# EasyEDA Pro project ProProject_Yuzuki Chameleon_2023-09-02.epro, schematic 100ASK

## Sheets
1 POWER
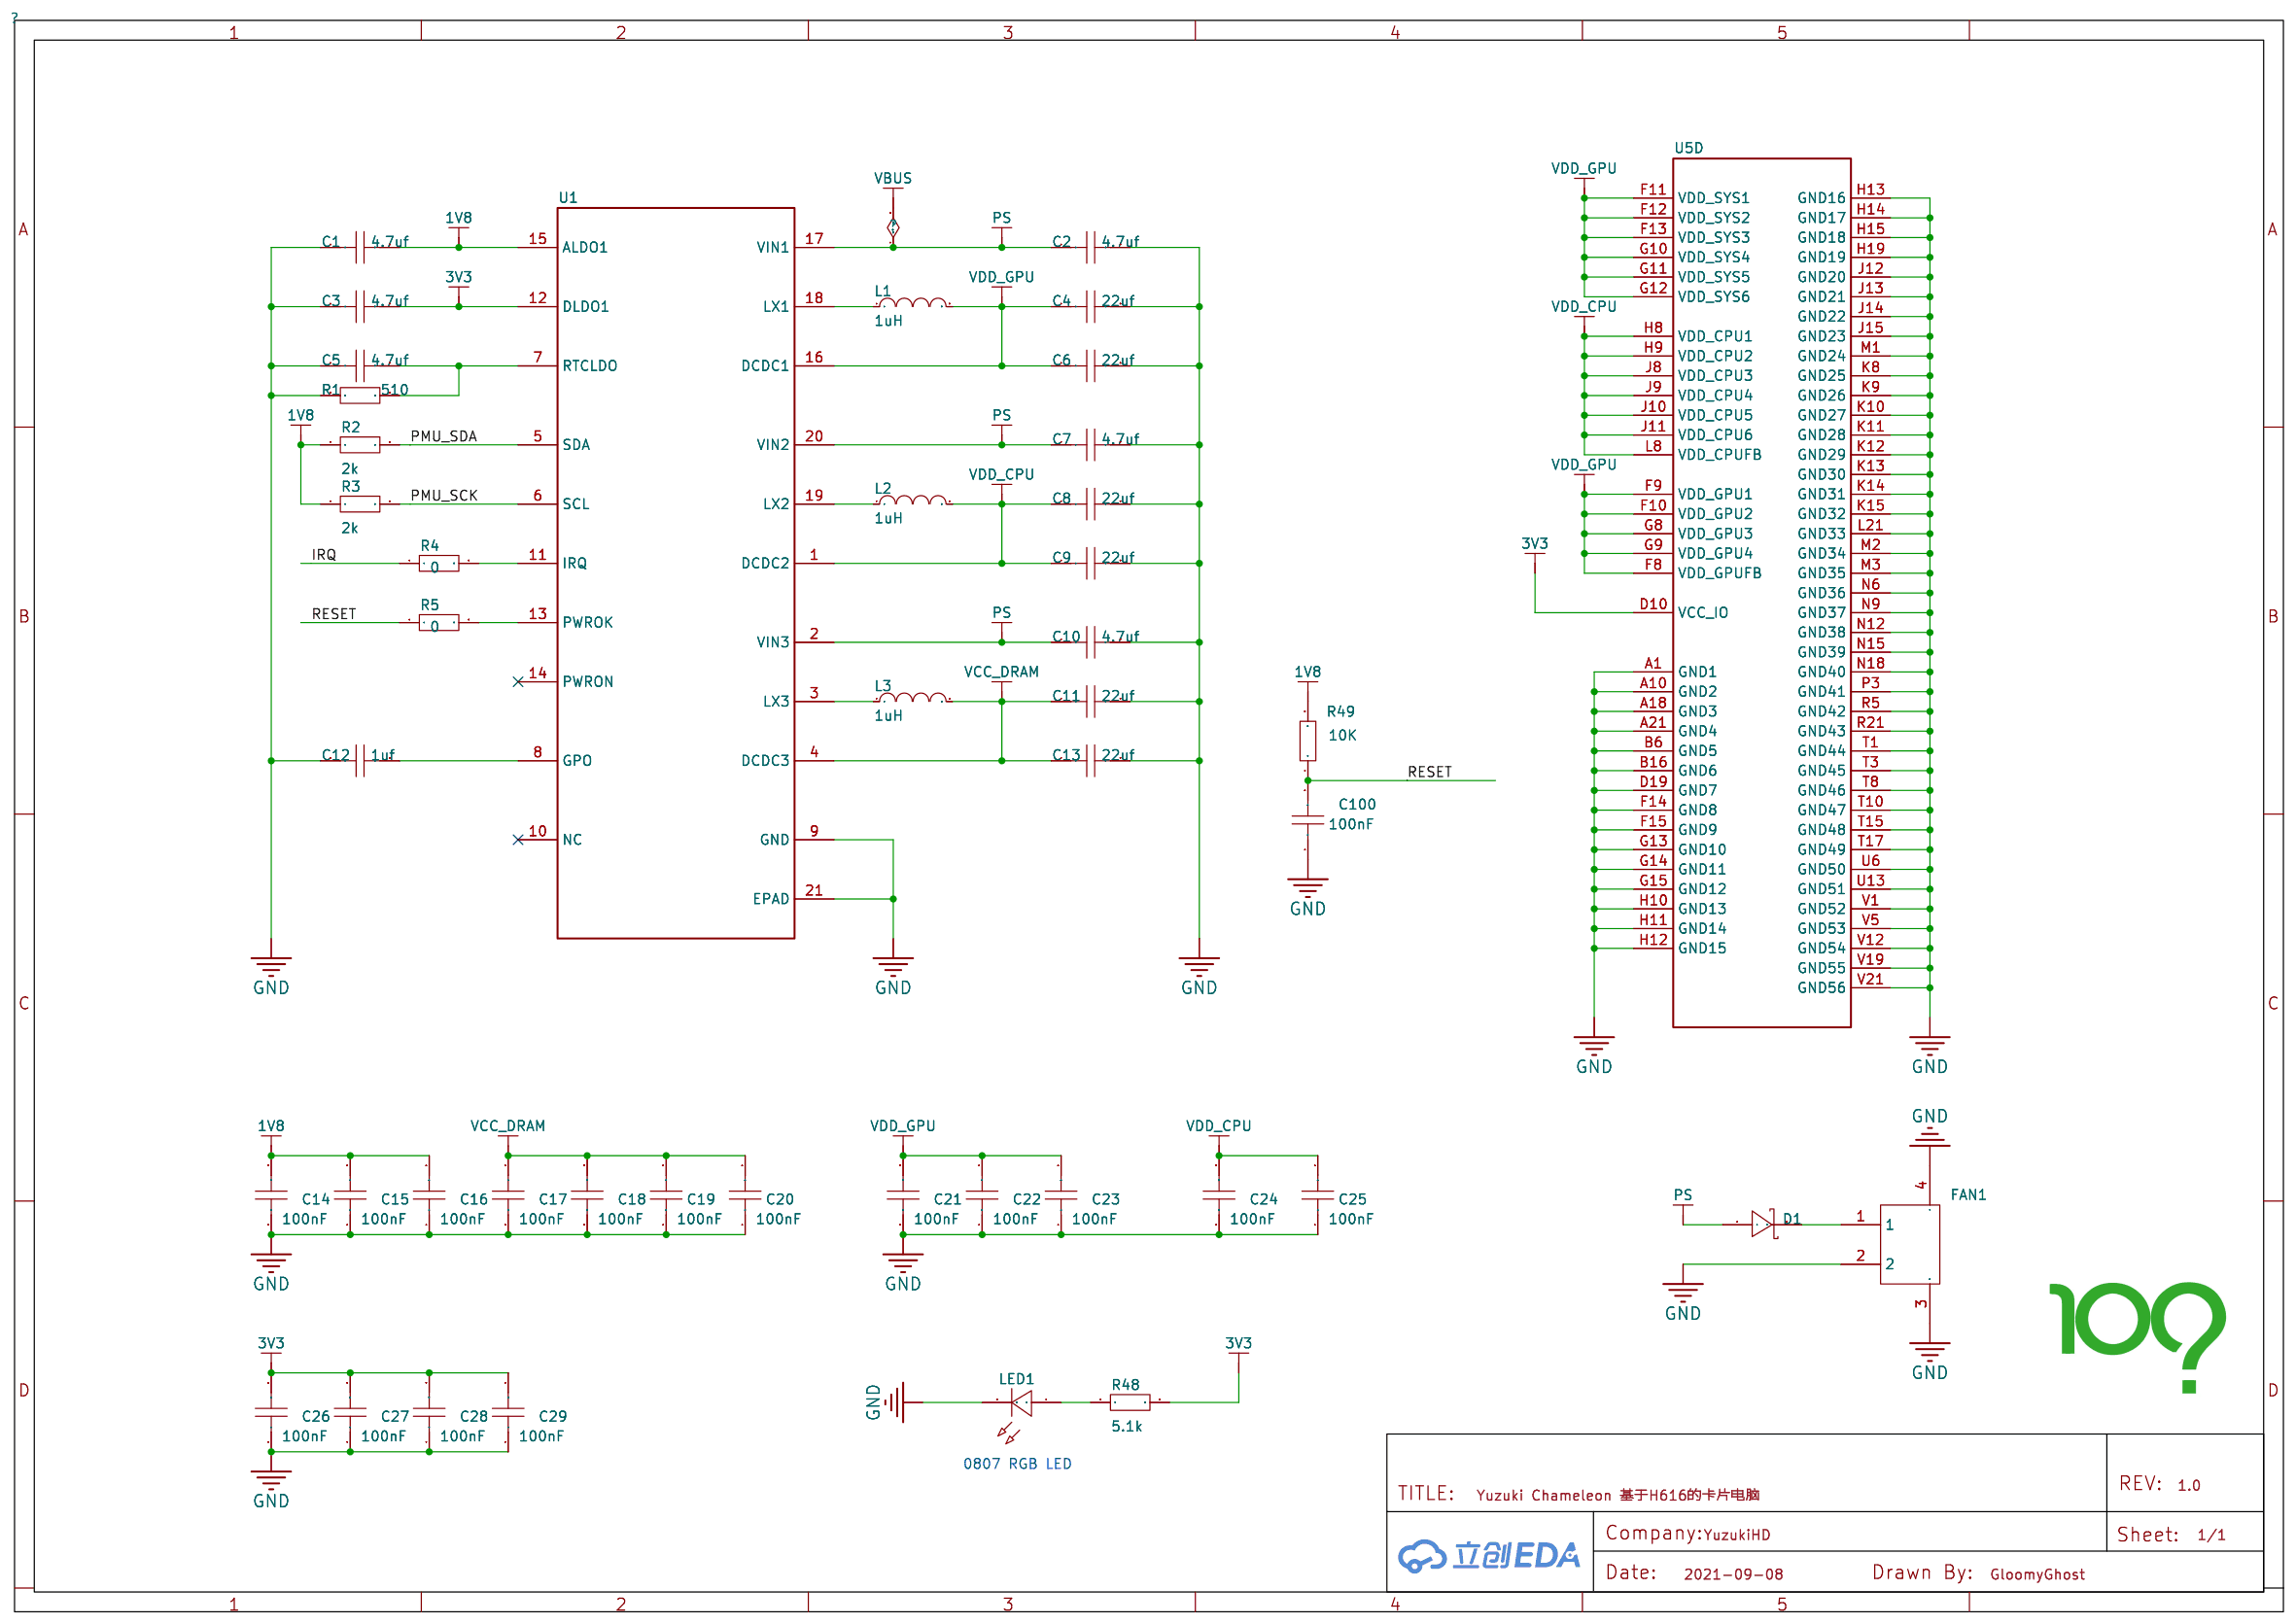
[diagram p0: POWER]
2 DRAM
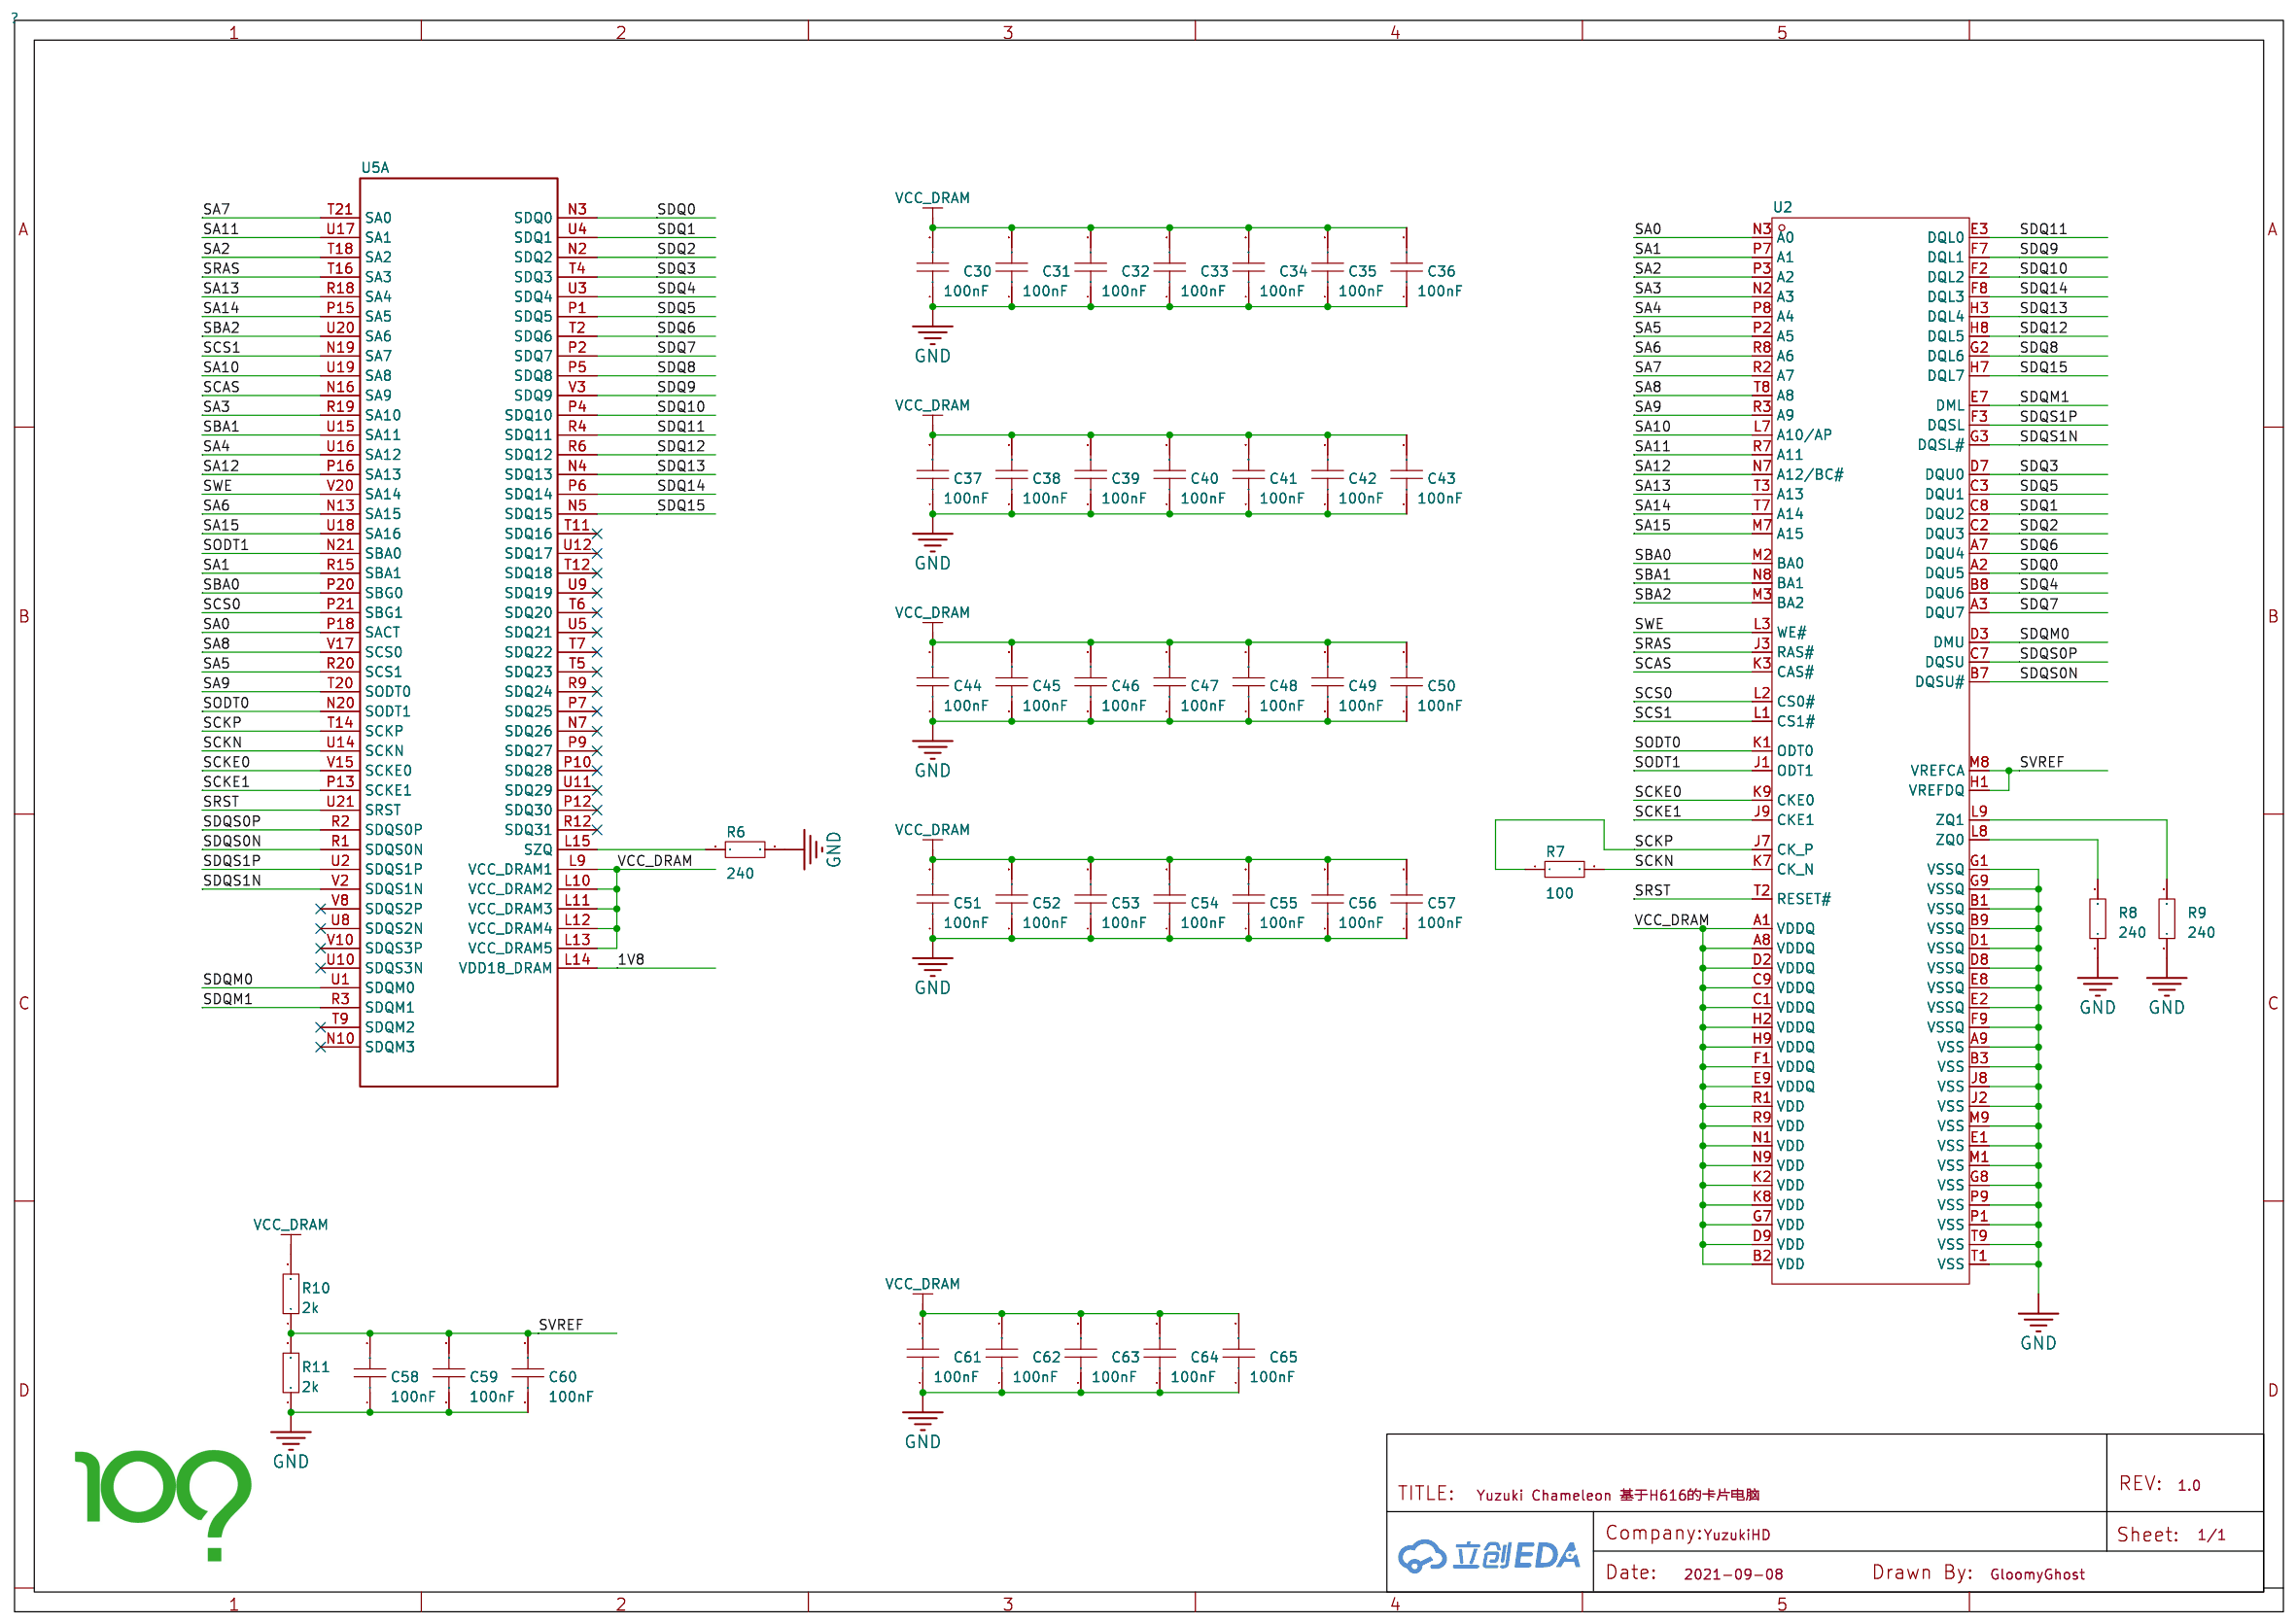
[diagram p1: DRAM]
3 IO
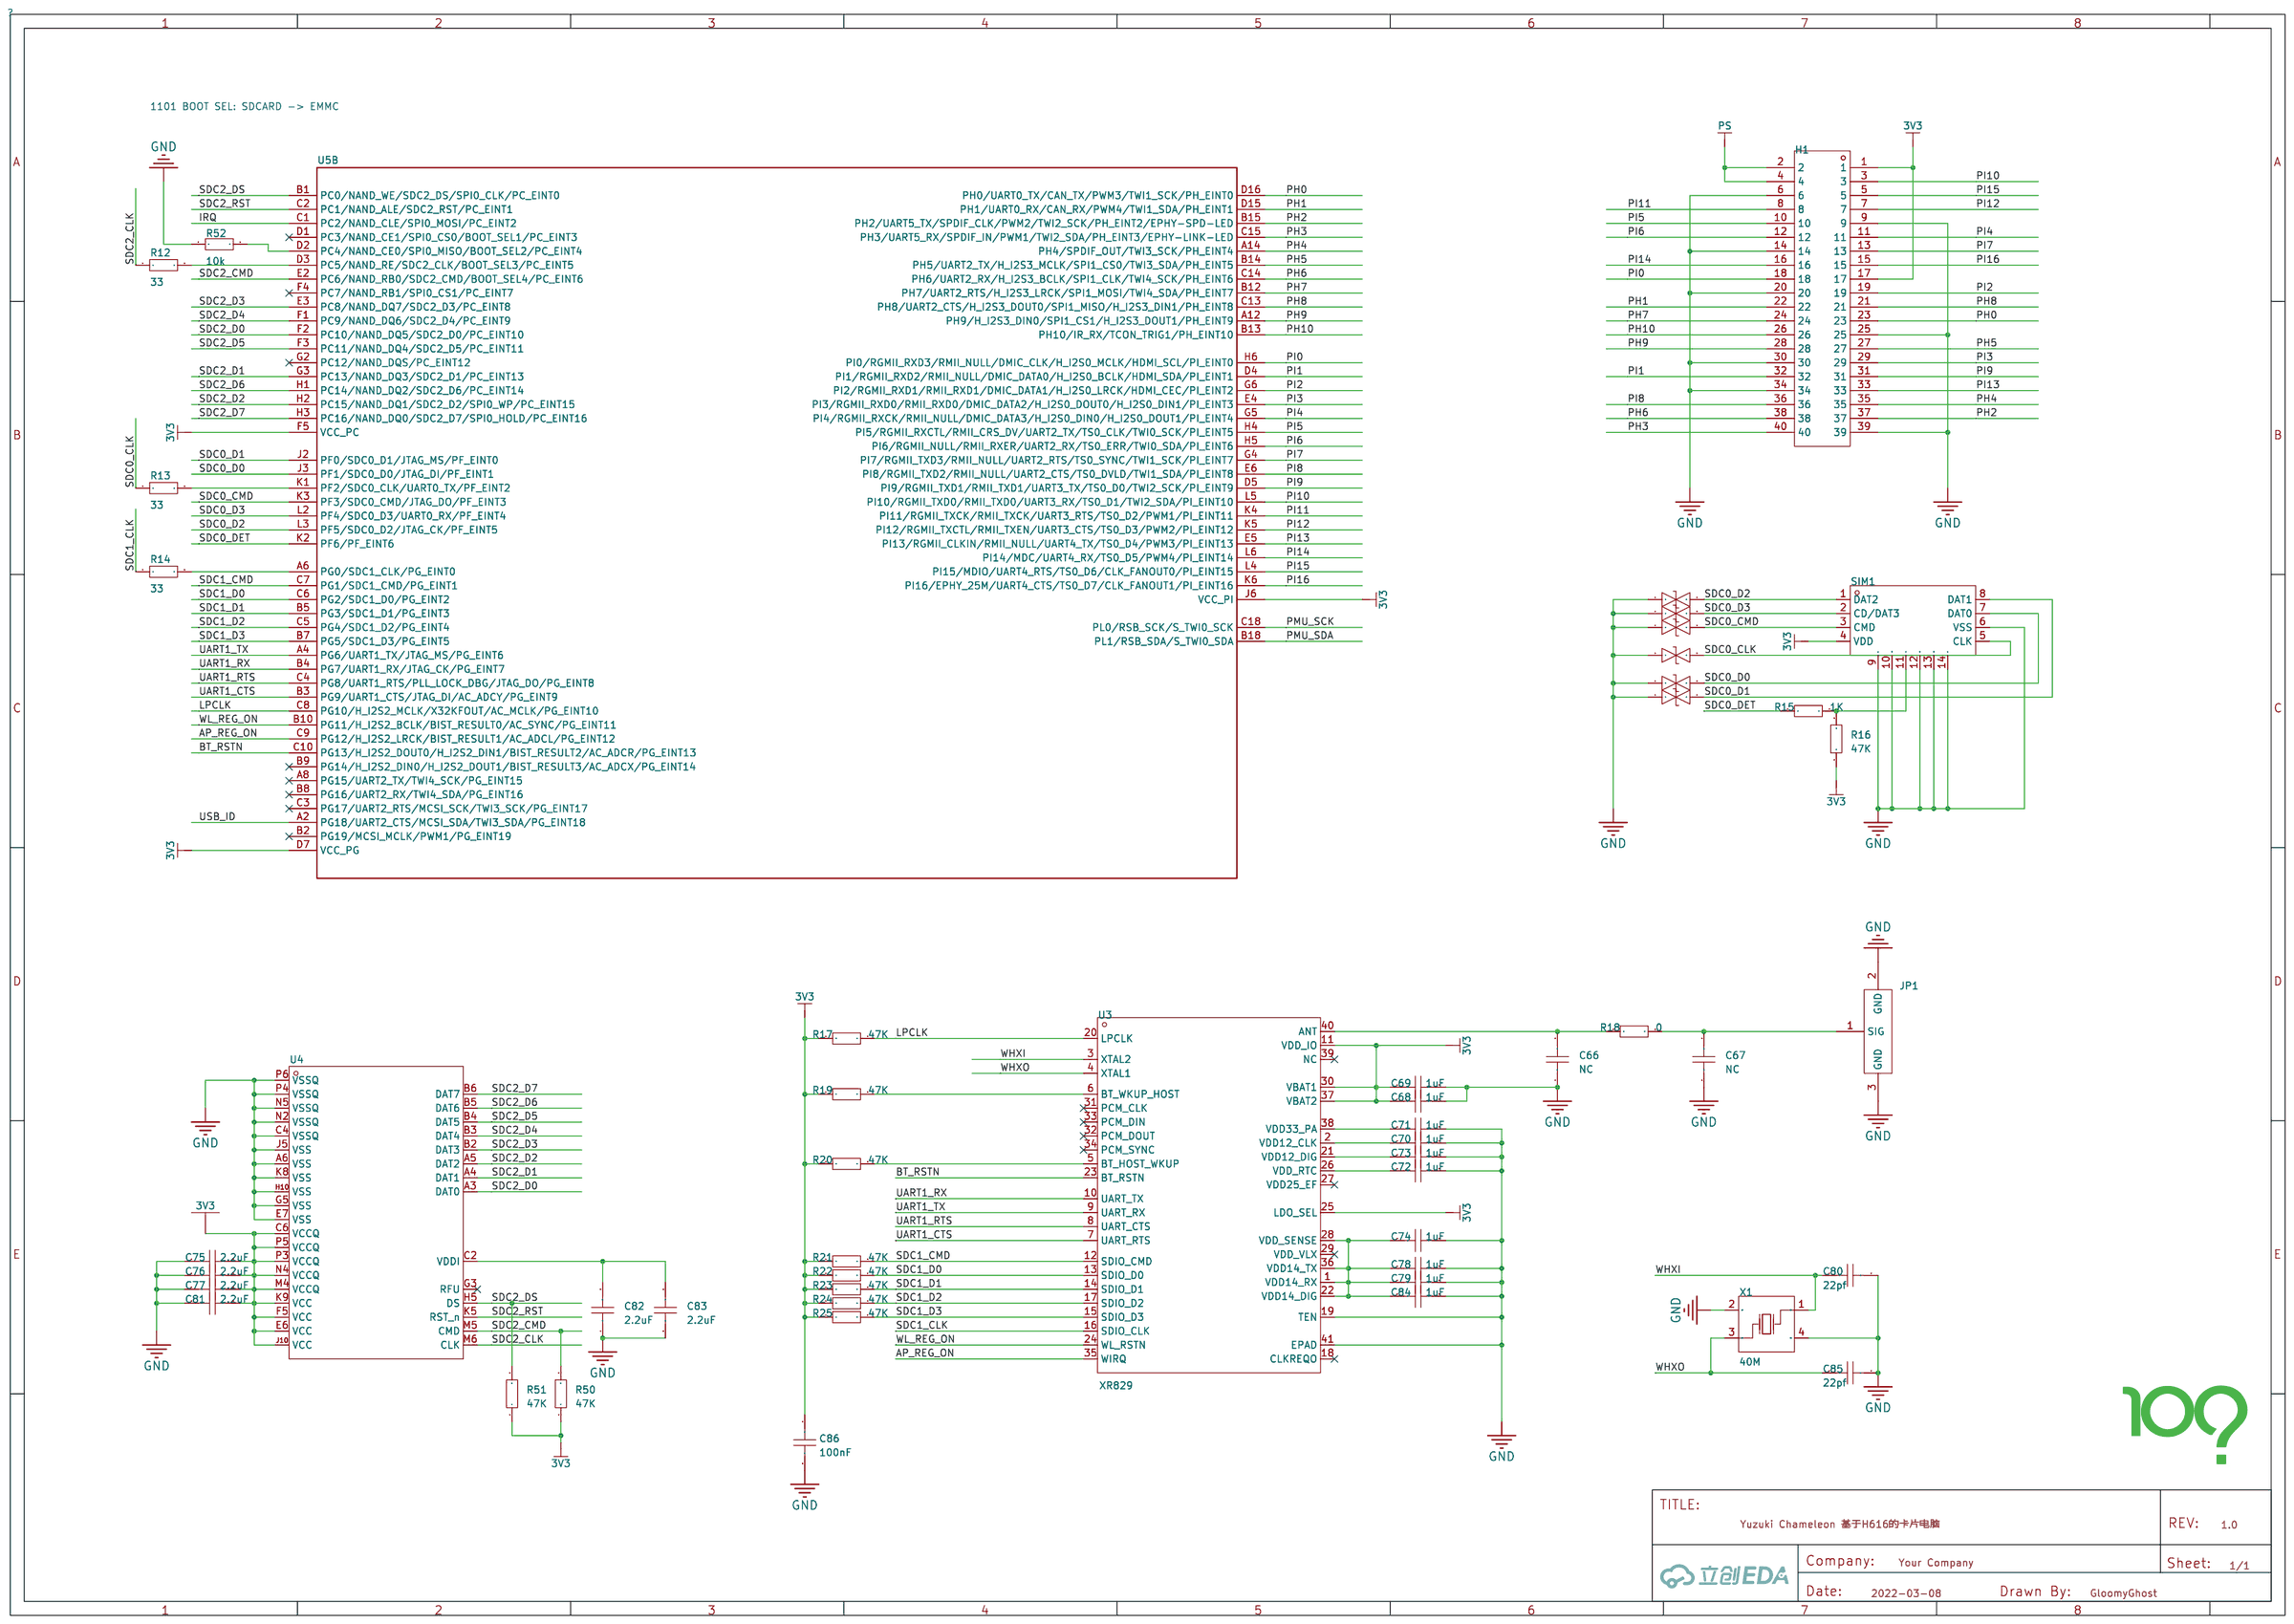
[diagram p2: IO]
4 PREP
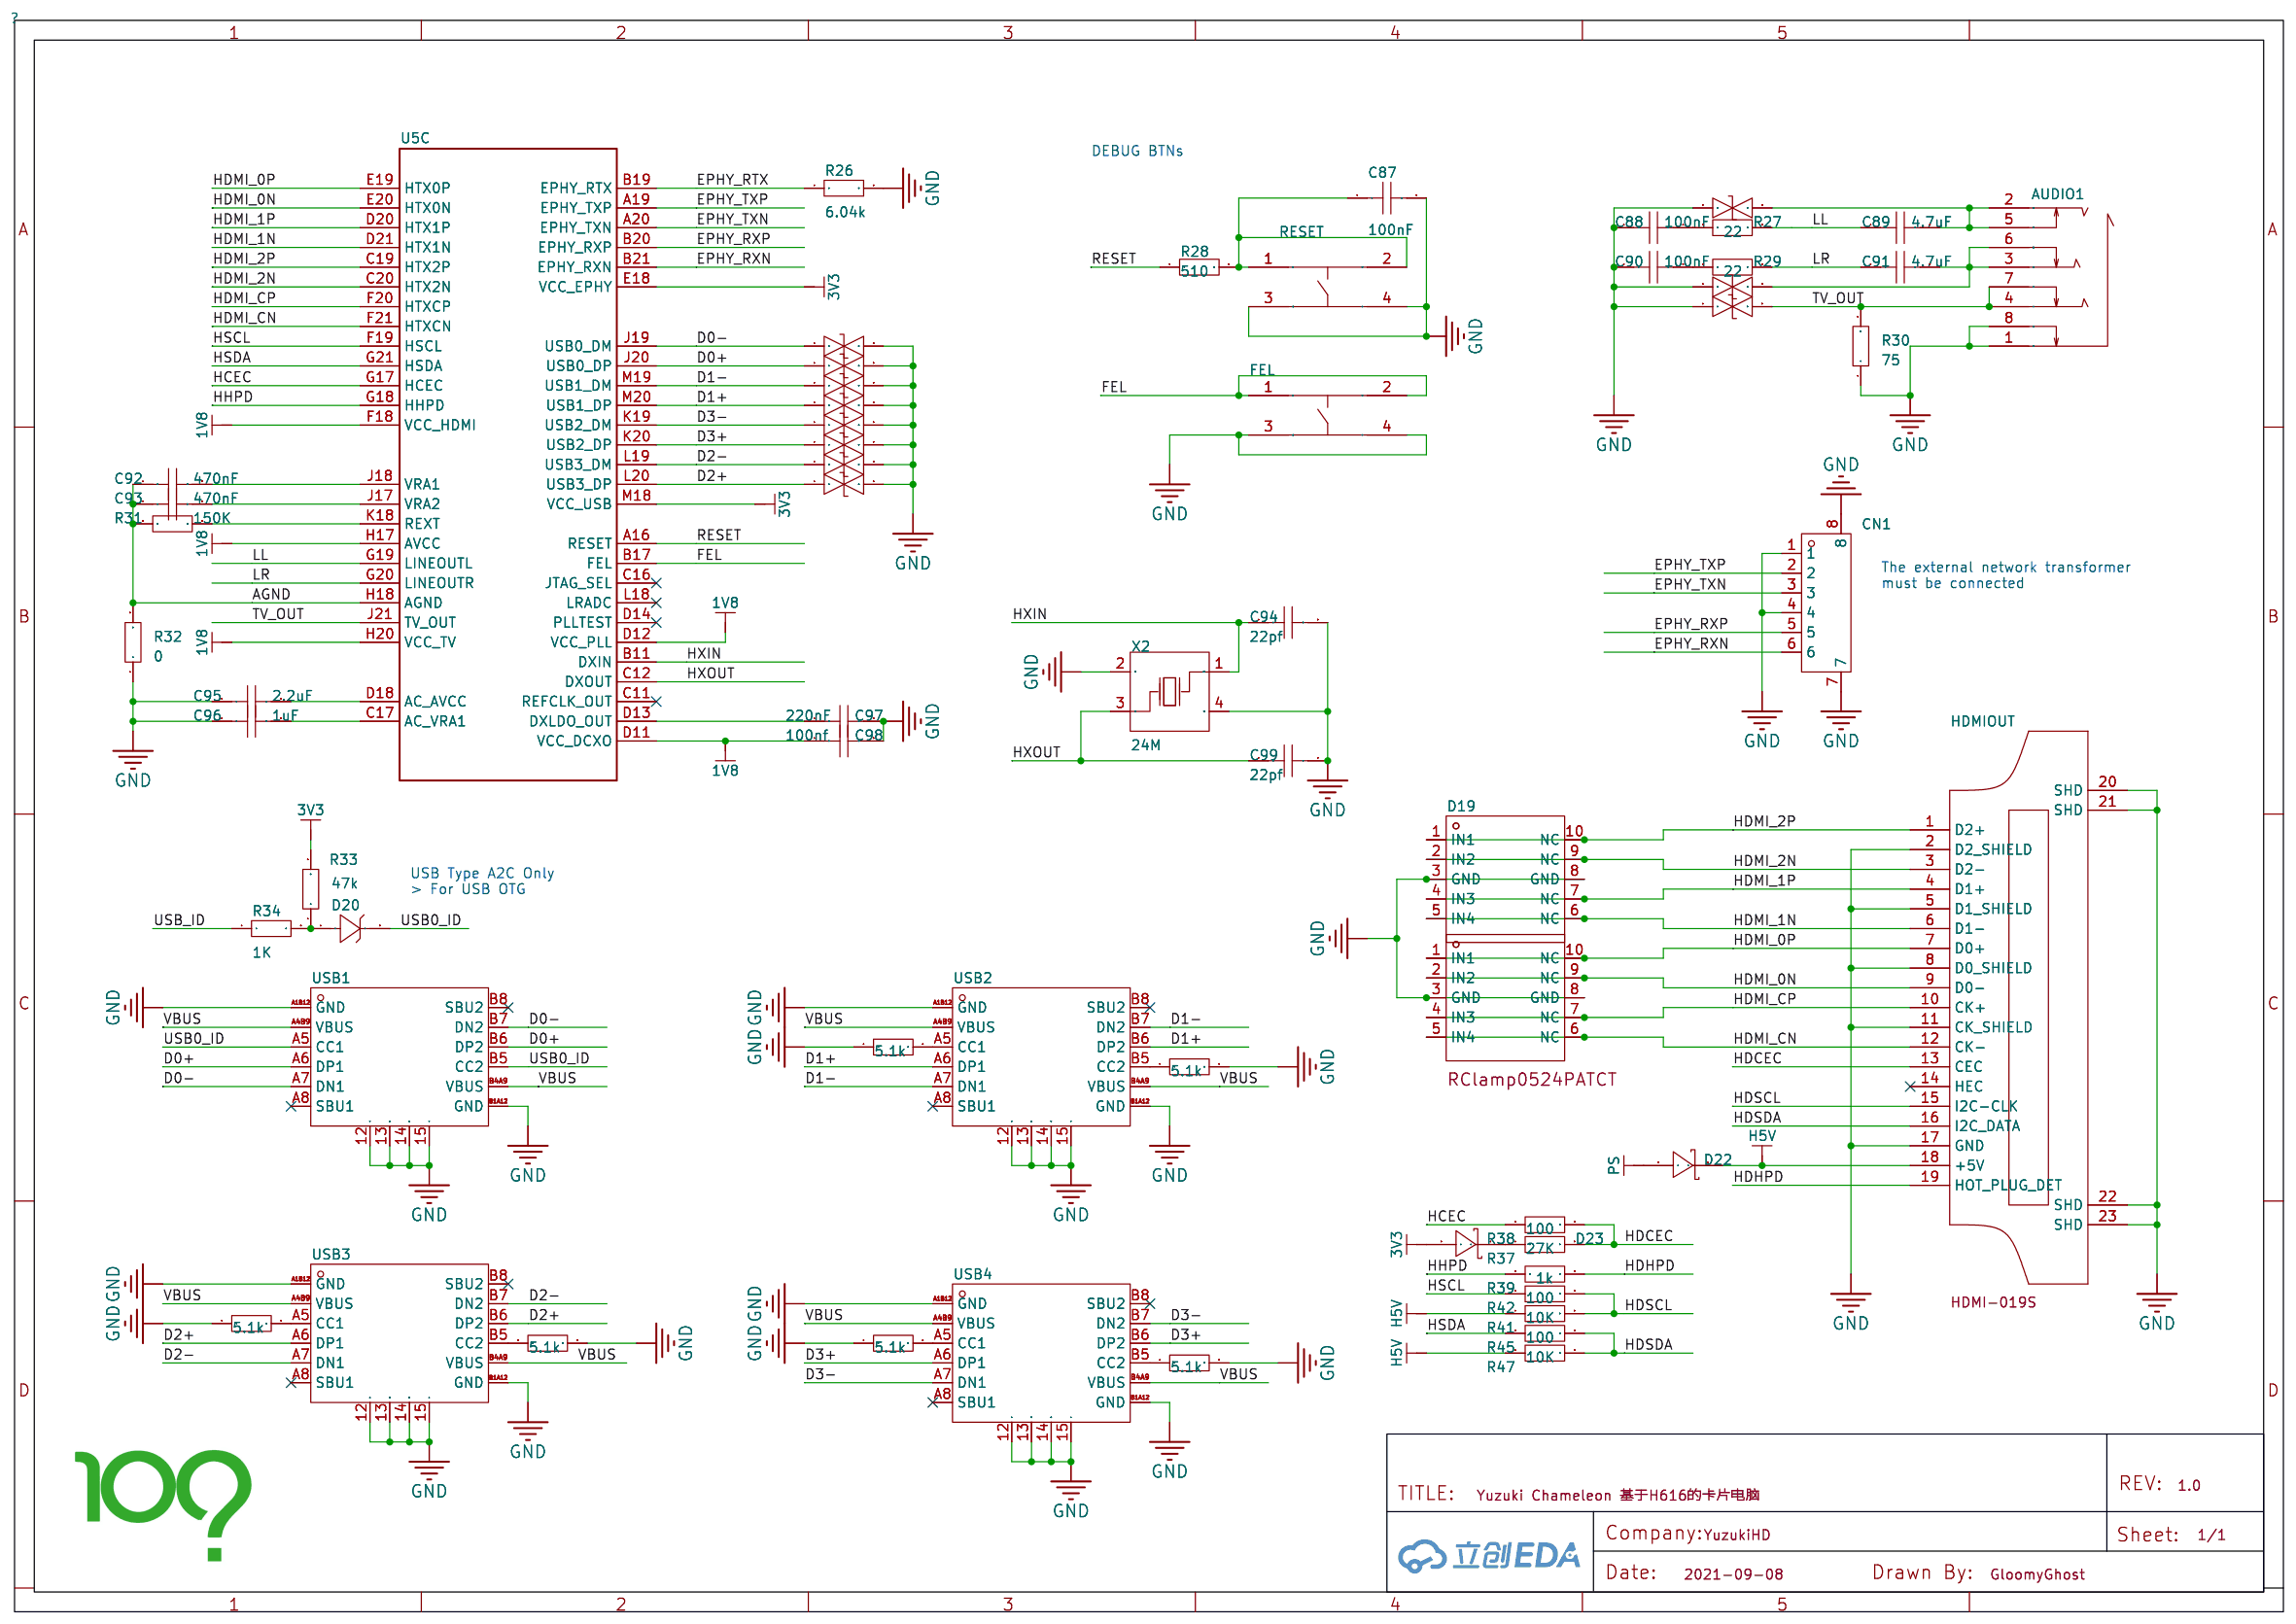
[diagram p3: PREP]

## Parts
sheet DRAM
C30  100nF  [C0402-NSK]
C31  100nF  [C0402-NSK]
C32  100nF  [C0402-NSK]
C33  100nF  [C0402-NSK]
C34  100nF  [C0402-NSK]
C35  100nF  [C0402-NSK]
C36  100nF  [C0402-NSK]
C37  100nF  [C0402-NSK]
C38  100nF  [C0402-NSK]
C39  100nF  [C0402-NSK]
C40  100nF  [C0402-NSK]
C41  100nF  [C0402-NSK]
C42  100nF  [C0402-NSK]
C43  100nF  [C0402-NSK]
C44  100nF  [C0402-NSK]
C45  100nF  [C0402-NSK]
C46  100nF  [C0402-NSK]
C47  100nF  [C0402-NSK]
C48  100nF  [C0402-NSK]
C49  100nF  [C0402-NSK]
C50  100nF  [C0402-NSK]
C51  100nF  [C0402-NSK]
C52  100nF  [C0402-NSK]
C53  100nF  [C0402-NSK]
C54  100nF  [C0402-NSK]
C55  100nF  [C0402-NSK]
C56  100nF  [C0402-NSK]
C57  100nF  [C0402-NSK]
C58  100nF  [C0402-NSK]
C59  100nF  [C0402-NSK]
C60  100nF  [C0402-NSK]
C61  100nF  [C0402-NSK]
C62  100nF  [C0402-NSK]
C63  100nF  [C0402-NSK]
C64  100nF  [C0402-NSK]
C65  100nF  [C0402-NSK]
R6  240  [R0402-NSK_2]
R7  100  [R0402-NSK_2]
R8  240  [R0402-NSK_2]
R9  240  [R0402-NSK_2]
R10  2k  [R0402-NSK_2]
R11  2k  [R0402-NSK_2]
U2  -  [FBGA96]
sheet IO
C66  NC  [C0402-NSK]
C67  NC  [C0402-NSK]
C68  1uF  [C0402-NSK]
C69  1uF  [C0402-NSK]
C70  1uF  [C0402-NSK]
C71  1uF  [C0402-NSK]
C72  1uF  [C0402-NSK]
C73  1uF  [C0402-NSK]
C74  1uF  [C0402-NSK]
C75  2.2uF  [C0402-NSK]
C76  2.2uF  [C0402-NSK]
C77  2.2uF  [C0402-NSK]
C78  1uF  [C0402-NSK]
C79  1uF  [C0402-NSK]
C80  22pf  [C0402-NSK]
C81  2.2uF  [C0402-NSK]
C82  2.2uF  [C0402-NSK]
C83  2.2uF  [C0402-NSK]
C84  1uF  [C0402-NSK]
C85  22pf  [C0402-NSK]
C86  100nF  [c0402-nsk_1]
D2  -  [D0402]
D3  -  [D0402]
D4  -  [D0402]
D5  -  [D0402]
D6  -  [D0402]
D7  -  [D0402]
H1  -  [HDR-TH_40P-P2.54-V-M-R2-C20-S2.54]
JP1  -  [RF-SMD_734120114]
R12  33  [R0402-NSK_2]
R13  33  [R0402-NSK_2]
R14  33  [R0402-NSK_2]
R15  1K  [R0402-NSK_2]
R16  47K  [R0402-NSK_2]
R17  47K  [R0402-NSK_2]
R18  0  [R0402-NSK_2]
R19  47K  [R0402-NSK_2]
R20  47K  [R0402-NSK_2]
R21  47K  [R0402-NSK_2]
R22  47K  [R0402-NSK_2]
R23  47K  [R0402-NSK_2]
R24  47K  [R0402-NSK_2]
R25  47K  [R0402-NSK_2]
R50  47K  [R0402-NSK_2]
R51  47K  [R0402-NSK_2]
R52  10k  [R0402-NSK_2]
SIM1  -  [SIM-SMD_8P-1040310811]
U3  XR829  [QFN-40_L5.0-W5.0-P0.40-BL-EP3.4]
U4  -  [FBGA-153_L13.0-W11.5]
X1  -  [OSC-SMD_4P-L2.0-W1.6-BL]
sheet POWER
C1  4.7uf  [C0402-NSK]
C2  4.7uf  [C0603 NSK]
C3  4.7uf  [C0402-NSK]
C4  22uf  [C0603 NSK]
C5  4.7uf  [C0402-NSK]
C6  22uf  [C0603 NSK]
C7  4.7uf  [C0603 NSK]
C8  22uf  [C0603 NSK]
C9  22uf  [C0603 NSK]
C10  4.7uf  [C0603 NSK]
C11  22uf  [C0603 NSK]
C12  1uf  [C0402-NSK]
C13  22uf  [C0603 NSK]
C14  100nF  [C0402-NSK]
C15  100nF  [C0402-NSK]
C16  100nF  [C0402-NSK]
C17  100nF  [C0402-NSK]
C18  100nF  [C0402-NSK]
C19  100nF  [C0402-NSK]
C20  100nF  [C0402-NSK]
C21  100nF  [C0402-NSK]
C22  100nF  [C0402-NSK]
C23  100nF  [C0402-NSK]
C24  100nF  [C0402-NSK]
C25  100nF  [C0402-NSK]
C26  100nF  [C0402-NSK]
C27  100nF  [C0402-NSK]
C28  100nF  [C0402-NSK]
C29  100nF  [C0402-NSK]
C100  100nF  [C0402-NSK]
D1  -  [SOD-323_L1.8-W1.3-LS2.5-NSK]
FAN1  -  [CONN-SMD_2P-P1.25_053398-0X71]
L1  1uH  [IND-SMD_L2.0-W1.6_1]
L2  1uH  [IND-SMD_L2.0-W1.6_1]
L3  1uH  [IND-SMD_L2.0-W1.6_1]
LED1  -  [RGBLED_0807]
R1  510  [R0402-NSK_2]
R2  2k  [R0402-NSK_2]
R3  2k  [R0402-NSK_2]
R4  0  [R0402-NSK_2]
R5  0  [R0402-NSK_2]
R48  5.1k  [R0402-NSK_2]
R49  10K  [R0402-NSK_2]
U1  AXP313A  [WQFN-20_L3.0-W3.0-P0.40-BL-EP]
U5  -  [BGA284P65B1200_1400H125]  (sections DRAM,IO,PLL-IO,POWER)
sheet PREP
AUDIO1  -  [AUDIO-TH_PJ-3930-8A]
C87  100nF  [C0402-NSK]
C88  100nF  [C0402-NSK]
C89  4.7uF  [C0402-NSK]
C90  100nF  [C0402-NSK]
C91  4.7uF  [C0402-NSK]
C92  470nF  [C0402-NSK]
C93  470nF  [C0402-NSK]
C94  22pf  [C0402-NSK]
C95  2.2uF  [C0402-NSK]
C96  1uF  [C0402-NSK]
C97  220nF  [C0402-NSK]
C98  100nf  [C0402-NSK]
C99  22pf  [C0402-NSK]
CN1  -  [CONN-SMD_6P-P1.25_53261-0671]
D8  -  [D0402]
D9  -  [D0402]
D10  -  [D0402]
D11  -  [D0402]
D12  -  [D0402]
D13  -  [D0402]
D14  -  [D0402]
D15  -  [D0402]
D16  -  [D0402]
D17  -  [D0402]
D18  -  [D0402]
D19  -  [SLP2510P8_L2.5-W1.0-P0.50-BL]
D20  -  [SOD-523_L1.2-W0.8-LS1.6-FD]
D21  -  [SLP2510P8_L2.5-W1.0-P0.50-BL]
D22  -  [SOD-323_L1.8-W1.3-LS2.5-NSK]
D23  -  [SOD-323_L1.8-W1.3-LS2.5-NSK]
FEL  -  [KEY-SMD_4P-L4.2-W3.2-P2.20-LS4.6_1]
HDMIOUT  -  [HDMI-SMD_HDMI-019S]
R26  6.04k  [R0402-NSK_2]
R27  22  [R0402-NSK_2]
R28  510  [R0402-NSK_2]
R29  22  [R0402-NSK_2]
R30  75  [R0402-NSK_2]
R31  150K  [R0402-NSK_2]
R32  0  [R0402-NSK_2]
R33  47k  [R0402-NSK_2]
R34  1K  [R0402-NSK_2]
R35  5.1k  [R0402-NSK_2]
R36  5.1k  [R0402-NSK_2]
R37  27K  [R0402-NSK_2]
R38  100  [R0402-NSK_2]
R39  1k  [R0402-NSK_2]
R40  5.1k  [R0402-NSK_2]
R41  10K  [R0402-NSK_2]
R42  100  [R0402-NSK_2]
R43  5.1k  [R0402-NSK_2]
R44  5.1k  [R0402-NSK_2]
R45  100  [R0402-NSK_2]
R46  5.1k  [R0402-NSK_2]
R47  10K  [R0402-NSK_2]
RESET  -  [KEY-SMD_4P-L4.2-W3.2-P2.20-LS4.6_1]
USB1  -  [USB-C-SMD_TYPEC-304-BCP16-1]
USB2  -  [USB-C-SMD_TYPEC-304-BCP16-1]
USB3  -  [USB-C-SMD_TYPEC-304-BCP16-1]
USB4  -  [USB-C-SMD_TYPEC-304-BCP16-1]
X2  -  [OSC-SMD_4P-L2.0-W1.6-BL]

## Library data of the parts
C1 C3 C5 C12 C14-C85 C88-C100 = CAP_0402: 容值:100nF;精度:±10%;额定电压:16V;温度系数:X7R;; Supplier Part: C1525; Supplier Footprint: 0402
R1-R27 R29-R52 = Res_0402: Supplier Footprint: 0402
U2 = H5TQ4G63EFR-RDC: Pin Type: IN; Supplier: LCSC; Supplier Part: C2803259; Manufacturer: HYNIX(海力士); JLCPCB Part Class: Extended Part
C86 C87 = FN15X104K250PNG: 容值:100nF;精度:±10%;额定电压:25V;温度系数:X7R;; LCSC Part Name: 100nF ±10% 25V; Supplier Part: C525225; Manufacturer: PSA(信昌电陶); Supplier Footprint: 0402; JLCPCB Part Class: Extended Part; Datasheet: https://atta.szlcsc.com/upload/public/pdf/source/20200506/C436246_4EAA78C9048D88437BAF2CB7B8BE45FD.pdf; Supplier: LCSC; Tolerance: ±10%; Voltage Rated: 25V; Temperature Coefficient: X7R
D2-D18 = 0402ESDA-05N: 极性:Bidirectional;反向关断电压（典型值）:5V;击穿电压（最小值）:-;箝位电压:50V;峰值脉冲电流（10/1000us）:-;; Supplier Part: C316049; Manufacturer: BORN伯恩半导体; Supplier Footprint: 0402; JLCPCB Part Class: Extended Part; Datasheet: https://atta.szlcsc.com/upload/public/pdf/source/20181026/C316049_37ABAC87650F175221BFB473159300DE.pdf; Supplier: LCSC; Polarity: Bidirectional; Voltage - Reverse Standoff (Typ): 5V; Voltage - Clamping (Max) @ Ipp: 50V
H1 = B-2100S40P-B110: 间距:2.54mm;总PIN位数:40;排数:2;插针结构:2x20P;行距:2.54mm;安装类型:直插;圆针/方针:-;额定电流:-;额定电压:-;配合针长度:6mm;塑高:2.54mm;端接针长度:3mm;触头材质:黄铜;触头镀层:-;工作温度范围:-40~+105;颜色:黑色;; LCSC Part Name: 2.54mm 2x20P; Supplier Part: C124383; Manufacturer: Ckmtw(灿科盟); Supplier Footprint: 插件,P=2.54mm; JLCPCB Part Class: Extended Part; Datasheet: https://atta.szlcsc.com/upload/public/pdf/source/20170821/C124383_1503303310291901537.pdf; Supplier: LCSC; Pitch: 2.54mm; Number of Pins: 40; Number of Rows: 2; Pin Structure: 2x20P; Row Spacing: 2.54mm; Mounting Type: 直插; Length of Mating Pin: 6mm; Insulation Height: 2.54mm; Length of End Connection Pin: 3mm; Contact Material: 黄铜; Operating Temperature Range: -40~+105; Color: 黑色
JP1 = U.FL-R-SMT-1(80): 连接器类型:板端;射频系列:IPEX;接口类型:内针;端口数量:1;阻抗:50;频率-最大值:6GHz;样式:-;接口直径:2mm;接口长度/高度:1.25mm;工作温度范围:-40~+90;; LCSC Part Name: 3310472280，IPE-X板端 IPX接头，贴片; Supplier Part: C88374; Manufacturer: HRS(广濑); Supplier Footprint: SMD; JLCPCB Part Class: Extended Part; Datasheet: https://atta.szlcsc.com/upload/public/pdf/source/20161125/1480067868647.pdf; Supplier: LCSC; Impedance: 50; Operating Temperature Range: -40~+90
SIM1 = 1040310811: 卡连接方式:拔插式;卡类型:MicroSD卡(TF卡);连接器类型:卡座;本体最大高度:1.42mm;工作温度范围:-;; LCSC Part Name: 拔插式 MicroSD卡(TF卡) 卡座; Supplier Part: C585350; Manufacturer: MOLEX; Supplier Footprint: SMD; JLCPCB Part Class: Extended Part; Datasheet: https://atta.szlcsc.com/upload/public/pdf/source/20201117/C585350_D1F0B30BD23514449186B2E50ACE8BBF.pdf; Supplier: LCSC; Card Connection Mode: 拔插式; Card Type: MicroSD卡(TF卡); Connector Type: 卡座; Maximum Body Height: 1.42mm
U3 = XR829: Pin Type: IN; Manufacturer: Allwinner
U4 = EMMC BGA153: Pin Type: IN; Supplier: LCSC; Supplier Part: C577446; Manufacturer: Kingston(金士顿); Manufacturer Part: EMMC04G-M627-A01
X1 X2 = SX32Y024000BC1T: 晶振类型:-;频率:-;频率公差:-;频率稳定度:-;负载电容:-;工作温度:-;; LCSC Part Name: 3225 24M 12PF  10ppm  -20 -75; Supplier Part: C271629; Manufacturer: TKD(泰晶); Supplier Footprint: SMD3225-4P; JLCPCB Part Class: Extended Part; Datasheet: https://atta.szlcsc.com/upload/public/pdf/source/20180829/C271629_CA81D930E8823EB83EE4F79A596DDEFE.pdf; Supplier: LCSC
C2 C4 C6-C11 C13 = CAP_0603: 容值:100nF;精度:±10%;额定电压:50V;温度系数:X7R;; Supplier Footprint: 0603
D1 D22 D23 = B5819WS: 直流反向耐压(Vr):40V;平均整流电流(Io):1A;正向压降(Vf):600mV@1A;; LCSC Part Name: 40V 1A 600mV@1A; Supplier Part: C22624; Manufacturer: CJ（江苏长电/长晶）; Supplier Footprint: SOD-323; JLCPCB Part Class: Extended Part; Datasheet: https://atta.szlcsc.com/upload/public/pdf/source/20170919/C22624_1505799673448977596.pdf; Supplier: LCSC; Reverse Voltage (Vr): 40V; Average Rectified Current (Io): 1A; Forward Voltage (Vf@If): 600mV@1A
FAN1 = 0533980271: 参考系列:-;间距:1.25mm;插针结构:1x2P;排数:1;每排PIN数:2;行距:-;公母:公型插针;安装方式:立贴;额定电流:-;工作温度范围:-;; LCSC Part Name: 线至板连接器,2触点,针座,1.25mm,贴装,1排; Supplier Part: C122410; Manufacturer: MOLEX; Supplier Footprint: SMD,P=1.25mm; JLCPCB Part Class: Extended Part; Datasheet: https://atta.szlcsc.com/upload/public/pdf/source/20170721/C122410_1500619309943834053.pdf; Supplier: LCSC; Pitch: 1.25mm; Pins Structure: 1x2P; Number of Rows: 1; Number of PINs Per Row: 2; Gender: 公型插针; Mounting Style: 立贴
L1-L3 = CKCS201610-2.2uH/M_2: 电感值:2.2uH;精度:±20%;额定电流:1.1A;直流电阻(DCR):264mΩ;; LCSC Part Name: 2.2uH ±20% 1.1A 264mΩ; Supplier Part: C354533; Manufacturer: CENKER(岑科); Manufacturer Part: CKCS201610-2.2uH/M; LCSC On Sale: 1; Supplier Footprint: SMD; JLCPCB Part Class: Extended Part; JLCPCB On Sale: 1; Datasheet: https://atta.szlcsc.com/upload/public/pdf/source/20190315/C354533_59121B22FE01331804674A67C9C7C2C4.pdf; Supplier: LCSC; Tolerance: ±20%; Rated Current: 1.1A; DC Resistance (DCR): 264mΩ
LED1 = LED_0805-G: Supplier Footprint: 0805
U1 = AXP1530: PCB Footprint: QFN21P40B300_300H78; Origin Footprint 2: QFN21P40B300_300H78
U5 = Allwinner_H616
AUDIO1 = PJ-3930-8A: 连接器类型:3.5mm耳机座;额定电流:500mA;额定电压:30V;; LCSC Part Name: 3.5mm耳机座; Supplier Part: C145811; Manufacturer: 韩国韩荣; Supplier Footprint: 插件; JLCPCB Part Class: Extended Part; Datasheet: https://atta.szlcsc.com/upload/public/pdf/source/20191118/C145811_16CC6EB1D99F73F69A2815454A66484C.pdf; Supplier: LCSC; Connector Type: 3.5mm耳机座; Current Rating (Max): 500mA; Voltage Rating (Max): 30V
CN1 = 532610671: 参考系列:-;间距:1.25mm;插针结构:1x6P;排数:1;每排PIN数:6;行距:-;安装方式:-;触头材质:青铜;; Supplier Part: C99277; Manufacturer: MOLEX; JLCPCB Part Class: Extended Part; Datasheet: https://atta.szlcsc.com/upload/public/pdf/source/20180713/C99277_7A4A98FEF11A2209B5FFC17F14BF7E54.pdf; Supplier: LCSC; Pitch: 1.25mm; Pins Structure: 1x6P; Number of Rows: 1; Number of PINs Per Row: 6; Contact Material: 青铜
D19 D21 = RClamp0524PATCT: VBR=6V， Vc=15V ，Ipp=5A; Supplier Part: C40960; Manufacturer: SEMTECH; Supplier Footprint: SLP2510P8; JLCPCB Part Class: Extended Part; Datasheet: https://atta.szlcsc.com/upload/public/pdf/source/20150124/1457707260739.pdf; Supplier: LCSC
D20 = 1N5819-SOD523: Supplier Part: C9900001291; Supplier Footprint: SOD-523_L1.2-W0.8-LS1.60; JLCPCB Part Class: Extended Part; Supplier: LCSC
FEL RESET = PTS810SJM250SMTRLFS: 触点电流:50mA;额定电压(DC):16V;电路结构:单刀单掷;安装方式:立贴;按钮形状:圆形按钮;带灯:-;开关长度:4.2mm;开关宽度:3.2mm;开关高度:2.5mm;; Supplier Part: C116501; Manufacturer: C&K; Supplier Footprint: SMD; JLCPCB Part Class: Extended Part; Datasheet: https://atta.szlcsc.com/upload/public/pdf/source/20180704/C116501_199B7AD0EF93D1F69D47FA53D559C299.pdf; Supplier: LCSC; Contact Current: 50mA; Voltage Rating (DC): 16V; Circuit: 单刀单掷; Mounting Style: 立贴; Actuator Style: 圆形按钮; Switch Length: 4.2mm; Switch Width: 3.2mm; Switch Height: 2.5mm
HDMIOUT = HDMI-019S: 连接器类型:HDMI;公母:母;总PIN位数:19;排数:-;安装方式:卧贴;额定电流:500mA;工作温度范围:-25~+75;; LCSC Part Name: HDMI 母 P数:19; Supplier Part: C111617; Manufacturer: SOFNG(硕方); Supplier Footprint: SMD; JLCPCB Part Class: Extended Part; Datasheet: https://atta.szlcsc.com/upload/public/pdf/source/20200911/C111617_84DD1BD35B9EB8A28224A63520745D0A.pdf; Supplier: LCSC; Connector Type: HDMI; Gender: 母; Number of Pins: 19; Mounting Style: 卧贴; Current Rating (Max): 500mA; Operating Temperature Range: -25~+75
R28 = TR0402D10K0Q1025Z: 电阻类型:薄膜电阻;阻值:10kΩ;精度:±0.5%;功率:63mW;温度系数:±25ppm/;最大工作电压:25V;工作温度范围:-55~+155;; LCSC Part Name: 10kΩ ±0.5%; Supplier Part: C149898; Manufacturer: EVER OHMS(天二科技); Supplier Footprint: 0402; JLCPCB Part Class: Extended Part; Datasheet: https://atta.szlcsc.com/upload/public/pdf/source/20190415/C149898_7B08651CD36798FFD08F99A8D38CFCAF.pdf; Supplier: LCSC; Type: 薄膜电阻; Tolerance: ±0.5%; Power(Watts): 63mW; Temperature Coefficient: ±25ppm/; Overload Voltage (Max): 25V; Operating Temperature Range: -55~+155
USB1-USB4 = TYPEC-304-BCP16: Pin Type: IN; Supplier: LCSC; Supplier Part: C720629; Manufacturer: XUNPU; JLCPCB Part Class: Extended Part

## Nets
1V8: C1.2 C14.2 C15.2 C16.2 C98.1 R2.1 R3.1 R49.2 U1.15(ALDO1) U5.D11(VCC_DCXO) U5.D12(VCC_PLL) U5.F18(VCC_HDMI) U5.H17(AVCC) U5.H20(VCC_TV) U5.L14(VDD18_DRAM)
3V3: C3.2 C26.2 C27.2 C28.2 C29.2 C68.1 C69.1 C75.2 C76.2 C77.2 C81.2 C86.2 D23.2(A) H1.1 H1.17 R16.1 R17.1 R19.1 R20.1 R21.1 R22.1 R23.1 R24.1 R25.1 R33.2 R48.2 R50.1 R51.1 SIM1.4(VDD) U1.12(DLDO1) U3.11(VDD_IO) U3.25(LDO_SEL) U3.30(VBAT1) U3.37(VBAT2) U4.C6(VCCQ) U4.E6(VCC) U4.F5(VCC) U4.J10(VCC) U4.K9(VCC) U4.M4(VCCQ) U4.N4(VCCQ) U4.P3(VCCQ) U4.P5(VCCQ) U5.D7(VCC_PG) U5.D10(VCC_IO) U5.E18(VCC_EPHY) U5.F5(VCC_PC) U5.J6(VCC_PI) U5.M18(VCC_USB)
AGND: C92.1 C93.1 R31.1 R32.2 U5.H18(AGND)
GND: AUDIO1.1 AUDIO1.8 C1.1 C2.2 C3.1 C4.2 C5.1 C6.2 C7.2 C8.2 C9.2 C10.2 C11.2 C12.1 C13.2 C14.1 C15.1 C16.1 C17.1 C18.1 C19.1 C20.1 C21.1 C22.1 C23.1 C24.1 C25.1 C26.1 C27.1 C28.1 C29.1 C30.1 C31.1 C32.1 C33.1 C34.1 C35.1 C36.1 C37.1 C38.1 C39.1 C40.1 C41.1 C42.1 C43.1 C44.1 C45.1 C46.1 C47.1 C48.1 C49.1 C50.1 C51.1 C52.1 C53.1 C54.1 C55.1 C56.1 C57.1 C58.1 C59.1 C60.1 C61.1 C62.1 C63.1 C64.1 C65.1 C66.1 C67.1 C68.2 C69.2 C70.2 C71.2 C72.2 C73.2 C74.2 C75.1 C76.1 C77.1 C78.2 C79.2 C80.2 C81.1 C82.1 C83.1 C84.2 C85.2 C86.1 C87.2 C88.1 C90.1 C94.2 C95.1 C96.1 C97.2 C98.2 C99.2 C100.1 CN1.1 CN1.4 CN1.7 CN1.8 D2.1 D3.1 D4.1 D5.1 D6.1 D7.1 D8.1 D9.2 D10.1 D11.2 D12.1 D13.2 D14.2 D15.2 D16.2 D17.2 D18.2 D19.3(GND) D19.8(GND) D21.3(GND) D21.8(GND) FAN1.2 FAN1.3 FAN1.4 FEL.3 FEL.4 H1.6 H1.9 H1.14 H1.20 H1.25 H1.30 H1.34 H1.39 HDMIOUT.2(D2_SHIELD) HDMIOUT.5(D1_SHIELD) HDMIOUT.8(D0_SHIELD) HDMIOUT.11(CK_SHIELD) HDMIOUT.17(GND) HDMIOUT.20(SHD) HDMIOUT.21(SHD) HDMIOUT.22(SHD) HDMIOUT.23(SHD) JP1.2(GND) JP1.3(GND) LED1.2(C) R1.1 R6.2 R8.1 R9.1 R11.1 R26.2 R30.1 R32.1 R35.1 R36.2 R40.1 R43.2 R44.1 R46.2 R52.2 RESET.3 RESET.4 SIM1.6(VSS) SIM1.9 SIM1.10 SIM1.12 SIM1.13 SIM1.14 U1.9(GND) U1.21(EPAD) U2.A9(VSS) U2.B1(VSSQ) U2.B3(VSS) U2.B9(VSSQ) U2.D1(VSSQ) U2.D8(VSSQ) U2.E1(VSS) U2.E2(VSSQ) U2.E8(VSSQ) U2.F9(VSSQ) U2.G1(VSSQ) U2.G8(VSS) U2.G9(VSSQ) U2.J2(VSS) U2.J8(VSS) U2.M1(VSS) U2.M9(VSS) U2.P1(VSS) U2.P9(VSS) U2.T1(VSS) U2.T9(VSS) U3.19(TEN) U3.41(EPAD) U4.A6(VSS) U4.C4(VSSQ) U4.E7(VSS) U4.G5(VSS) U4.H10(VSS) U4.J5(VSS) U4.K8(VSS) U4.N2(VSSQ) U4.N5(VSSQ) U4.P4(VSSQ) U4.P6(VSSQ) U5.A1(GND1) U5.A10(GND2) U5.A18(GND3) U5.A21(GND4) U5.B6(GND5) U5.B16(GND6) U5.D19(GND7) U5.F14(GND8) U5.F15(GND9) U5.G13(GND10) U5.G14(GND11) U5.G15(GND12) U5.H10(GND13) U5.H11(GND14) U5.H12(GND15) U5.H13(GND16) U5.H14(GND17) U5.H15(GND18) U5.H19(GND19) U5.J12(GND20) U5.J13(GND21) U5.J14(GND22) U5.J15(GND23) U5.K8(GND25) U5.K9(GND26) U5.K10(GND27) U5.K11(GND28) U5.K12(GND29) U5.K13(GND30) U5.K14(GND31) U5.K15(GND32) U5.L21(GND33) U5.M1(GND24) U5.M2(GND34) U5.M3(GND35) U5.N6(GND36) U5.N9(GND37) U5.N12(GND38) U5.N15(GND39) U5.N18(GND40) U5.P3(GND41) U5.R5(GND42) U5.R21(GND43) U5.T1(GND44) U5.T3(GND45) U5.T8(GND46) U5.T10(GND47) U5.T15(GND48) U5.T17(GND49) U5.U6(GND50) U5.U13(GND51) U5.V1(GND52) U5.V5(GND53) U5.V12(GND54) U5.V19(GND55) U5.V21(GND56) USB1.12(1) USB1.13(2) USB1.14(3) USB1.15(4) USB1.A1B12(GND) USB1.B1A12(GND) USB2.12(1) USB2.13(2) USB2.14(3) USB2.15(4) USB2.A1B12(GND) USB2.B1A12(GND) USB3.12(1) USB3.13(2) USB3.14(3) USB3.15(4) USB3.A1B12(GND) USB3.B1A12(GND) USB4.12(1) USB4.13(2) USB4.14(3) USB4.15(4) USB4.A1B12(GND) USB4.B1A12(GND) X1.2(GND) X1.4(GND) X2.2(GND) X2.4(GND)
VCC_DRAM: C11.1 C13.1 C17.2 C18.2 C19.2 C20.2 C30.2 C31.2 C32.2 C33.2 C34.2 C35.2 C36.2 C37.2 C38.2 C39.2 C40.2 C41.2 C42.2 C43.2 C44.2 C45.2 C46.2 C47.2 C48.2 C49.2 C50.2 C51.2 C52.2 C53.2 C54.2 C55.2 C56.2 C57.2 C61.2 C62.2 C63.2 C64.2 C65.2 L3.2 R10.2 U1.4(DCDC3) U2.A1(VDDQ) U2.A8(VDDQ) U2.B2(VDD) U2.C1(VDDQ) U2.C9(VDDQ) U2.D2(VDDQ) U2.D9(VDD) U2.E9(VDDQ) U2.F1(VDDQ) U2.G7(VDD) U2.H2(VDDQ) U2.H9(VDDQ) U2.K2(VDD) U2.K8(VDD) U2.N1(VDD) U2.N9(VDD) U2.R1(VDD) U2.R9(VDD) U5.L9(VCC_DRAM1) U5.L10(VCC_DRAM2) U5.L11(VCC_DRAM3) U5.L12(VCC_DRAM4) U5.L13(VCC_DRAM5)
VDD_CPU: C8.1 C9.1 C24.2 C25.2 L2.2 U1.1(DCDC2) U5.H8(VDD_CPU1) U5.H9(VDD_CPU2) U5.J8(VDD_CPU3) U5.J9(VDD_CPU4) U5.J10(VDD_CPU5) U5.J11(VDD_CPU6) U5.L8(VDD_CPUFB)
VDD_GPU: C4.1 C6.1 C21.2 C22.2 C23.2 L1.2 U1.16(DCDC1) U5.F8(VDD_GPUFB) U5.F9(VDD_GPU1) U5.F10(VDD_GPU2) U5.F11(VDD_SYS1) U5.F12(VDD_SYS2) U5.F13(VDD_SYS3) U5.G8(VDD_GPU3) U5.G9(VDD_GPU4) U5.G10(VDD_SYS4) U5.G11(VDD_SYS5) U5.G12(VDD_SYS6)
AP_REG_ON: U3.35(WIRQ) U5.C9(PG12/H_I2S2_LRCK/BIST_RESULT1/AC_ADCL/PG_EINT12)
BT_RSTN: U3.23(BT_RSTN) U5.C10(PG13/H_I2S2_DOUT0/H_I2S2_DIN1/BIST_RESULT2/AC_ADCR/PG_EINT13)
D0+: D11.1 U5.J20(USB0_DP) USB1.A6(DP1) USB1.B6(DP2)
D0-: D9.1 U5.J19(USB0_DM) USB1.A7(DN1) USB1.B7(DN2)
D1+: D14.1 U5.M20(USB1_DP) USB2.A6(DP1) USB2.B6(DP2)
D1-: D13.1 U5.M19(USB1_DM) USB2.A7(DN1) USB2.B7(DN2)
D2+: D18.1 U5.L20(USB3_DP) USB3.A6(DP1) USB3.B6(DP2)
D2-: D17.1 U5.L19(USB3_DM) USB3.A7(DN1) USB3.B7(DN2)
D3+: D16.1 U5.K20(USB2_DP) USB4.A6(DP1) USB4.B6(DP2)
D3-: D15.1 U5.K19(USB2_DM) USB4.A7(DN1) USB4.B7(DN2)
EPHY_RTX: R26.1 U5.B19(EPHY_RTX)
EPHY_RXN: CN1.6 U5.B21(EPHY_RXN)
EPHY_RXP: CN1.5 U5.B20(EPHY_RXP)
EPHY_TXN: CN1.3 U5.A20(EPHY_TXN)
EPHY_TXP: CN1.2 U5.A19(EPHY_TXP)
FEL: FEL.1 FEL.2 U5.B17(FEL)
H5V: D22.1(K) HDMIOUT.18(+5V) R41.1 R47.1
HCEC: R38.1 U5.G17(HCEC)
HDCEC: HDMIOUT.13(CEC) R37.2 R38.2
HDHPD: HDMIOUT.19(HOT_PLUG_DET) R39.2
HDMI_0N: D21.2(IN2) D21.9(NC) HDMIOUT.9(D0-) U5.E20(HTX0N)
HDMI_0P: D21.1(IN1) D21.10(NC) HDMIOUT.7(D0+) U5.E19(HTX0P)
HDMI_1N: D19.5(IN4) D19.6(NC) HDMIOUT.6(D1-) U5.D21(HTX1N)
HDMI_1P: D19.4(IN3) D19.7(NC) HDMIOUT.4(D1+) U5.D20(HTX1P)
HDMI_2N: D19.2(IN2) D19.9(NC) HDMIOUT.3(D2-) U5.C20(HTX2N)
HDMI_2P: D19.1(IN1) D19.10(NC) HDMIOUT.1(D2+) U5.C19(HTX2P)
HDMI_CN: D21.5(IN4) D21.6(NC) HDMIOUT.12(CK-) U5.F21(HTXCN)
HDMI_CP: D21.4(IN3) D21.7(NC) HDMIOUT.10(CK+) U5.F20(HTXCP)
HDSCL: HDMIOUT.15(I2C-CLK) R41.2 R42.2
HDSDA: HDMIOUT.16(I2C_DATA) R45.2 R47.2
HHPD: R39.1 U5.G18(HHPD)
HSCL: R42.1 U5.F19(HSCL)
HSDA: R45.1 U5.G21(HSDA)
HXIN: C94.1 U5.B11(DXIN) X2.1(OSC1)
HXOUT: C99.1 U5.C12(DXOUT) X2.3(OSC2)
IRQ: R4.1 U5.C1(PC2/NAND_CLE/SPI0_MOSI/PC_EINT2)
LL: C89.1 R27.2 U5.G19(LINEOUTL)
LPCLK: R17.2 U3.20(LPCLK) U5.C8(PG10/H_I2S2_MCLK/X32KFOUT/AC_MCLK/PG_EINT10)
LR: C91.1 R29.2 U5.G20(LINEOUTR)
PH0: H1.23 U5.D16(PH0/UART0_TX/CAN_TX/PWM3/TWI1_SCK/PH_EINT0)
PH1: H1.22 U5.D15(PH1/UART0_RX/CAN_RX/PWM4/TWI1_SDA/PH_EINT1)
PH2: H1.37 U5.B15(PH2/UART5_TX/SPDIF_CLK/PWM2/TWI2_SCK/PH_EINT2/EPHY-SPD-LED)
PH3: H1.40 U5.C15(PH3/UART5_RX/SPDIF_IN/PWM1/TWI2_SDA/PH_EINT3/EPHY-LINK-LED)
PH4: H1.35 U5.A14(PH4/SPDIF_OUT/TWI3_SCK/PH_EINT4)
PH5: H1.27 U5.B14(PH5/UART2_TX/H_I2S3_MCLK/SPI1_CS0/TWI3_SDA/PH_EINT5)
PH6: H1.38 U5.C14(PH6/UART2_RX/H_I2S3_BCLK/SPI1_CLK/TWI4_SCK/PH_EINT6)
PH7: H1.24 U5.B12(PH7/UART2_RTS/H_I2S3_LRCK/SPI1_MOSI/TWI4_SDA/PH_EINT7)
PH8: H1.21 U5.C13(PH8/UART2_CTS/H_I2S3_DOUT0/SPI1_MISO/H_I2S3_DIN1/PH_EINT8)
PH9: H1.28 U5.A12(PH9/H_I2S3_DIN0/SPI1_CS1/H_I2S3_DOUT1/PH_EINT9)
PH10: H1.26 U5.B13(PH10/IR_RX/TCON_TRIG1/PH_EINT10)
PI0: H1.18 U5.H6(PI0/RGMII_RXD3/RMII_NULL/DMIC_CLK/H_I2S0_MCLK/HDMI_SCL/PI_EINT0)
PI1: H1.32 U5.D4(PI1/RGMII_RXD2/RMII_NULL/DMIC_DATA0/H_I2S0_BCLK/HDMI_SDA/PI_EINT1)
PI2: H1.19 U5.G6(PI2/RGMII_RXD1/RMII_RXD1/DMIC_DATA1/H_I2S0_LRCK/HDMI_CEC/PI_EINT2)
PI3: H1.29 U5.E4(PI3/RGMII_RXD0/RMII_RXD0/DMIC_DATA2/H_I2S0_DOUT0/H_I2S0_DIN1/PI_EINT3)
PI4: H1.11 U5.G5(PI4/RGMII_RXCK/RMII_NULL/DMIC_DATA3/H_I2S0_DIN0/H_I2S0_DOUT1/PI_EINT4)
PI5: H1.10 U5.H4(PI5/RGMII_RXCTL/RMII_CRS_DV/UART2_TX/TS0_CLK/TWI0_SCK/PI_EINT5)
PI6: H1.12 U5.H5(PI6/RGMII_NULL/RMII_RXER/UART2_RX/TS0_ERR/TWI0_SDA/PI_EINT6)
PI7: H1.13 U5.G4(PI7/RGMII_TXD3/RMII_NULL/UART2_RTS/TS0_SYNC/TWI1_SCK/PI_EINT7)
PI8: H1.36 U5.E6(PI8/RGMII_TXD2/RMII_NULL/UART2_CTS/TS0_DVLD/TWI1_SDA/PI_EINT8)
PI9: H1.31 U5.D5(PI9/RGMII_TXD1/RMII_TXD1/UART3_TX/TS0_D0/TWI2_SCK/PI_EINT9)
PI10: H1.3 U5.L5(PI10/RGMII_TXD0/RMII_TXD0/UART3_RX/TS0_D1/TWI2_SDA/PI_EINT10)
PI11: H1.8 U5.K4(PI11/RGMII_TXCK/RMII_TXCK/UART3_RTS/TS0_D2/PWM1/PI_EINT11)
PI12: H1.7 U5.K5(PI12/RGMII_TXCTL/RMII_TXEN/UART3_CTS/TS0_D3/PWM2/PI_EINT12)
PI13: H1.33 U5.E5(PI13/RGMII_CLKIN/RMII_NULL/UART4_TX/TS0_D4/PWM3/PI_EINT13)
PI14: H1.16 U5.L6(PI14/MDC/UART4_RX/TS0_D5/PWM4/PI_EINT14)
PI15: H1.5 U5.L4(PI15/MDIO/UART4_RTS/TS0_D6/CLK_FANOUT0/PI_EINT15)
PI16: H1.15 U5.K6(PI16/EPHY_25M/UART4_CTS/TS0_D7/CLK_FANOUT1/PI_EINT16)
PMU_SCK: R3.2 U1.6(SCL) U5.C18(PL0/RSB_SCK/S_TWI0_SCK)
PMU_SDA: R2.2 U1.5(SDA) U5.B18(PL1/RSB_SDA/S_TWI0_SDA)
PS: C2.1 C7.1 C10.1 D1.2(A) D22.2(A) H1.2 H1.4 U1.2(VIN3) U1.17(VIN1) U1.20(VIN2) USB1.A4B9(VBUS) USB1.B4A9(VBUS) USB2.A4B9(VBUS) USB2.B4A9(VBUS) USB3.A4B9(VBUS) USB3.B4A9(VBUS) USB4.A4B9(VBUS) USB4.B4A9(VBUS)
RESET: C100.2 R5.1 R28.1 R49.1 U5.A16(RESET)
SA0: U2.N3(A0) U5.P18(SACT)
SA1: U2.P7(A1) U5.R15(SBA1)
SA2: U2.P3(A2) U5.T18(SA2)
SA3: U2.N2(A3) U5.R19(SA10)
SA4: U2.P8(A4) U5.U16(SA12)
SA5: U2.P2(A5) U5.R20(SCS1)
SA6: U2.R8(A6) U5.N13(SA15)
SA7: U2.R2(A7) U5.T21(SA0)
SA8: U2.T8(A8) U5.V17(SCS0)
SA9: U2.R3(A9) U5.T20(SODT0)
SA10: U2.L7(A10/AP) U5.U19(SA8)
SA11: U2.R7(A11) U5.U17(SA1)
SA12: U2.N7(A12/BC#) U5.P16(SA13)
SA13: U2.T3(A13) U5.R18(SA4)
SA14: U2.T7(A14) U5.P15(SA5)
SA15: U2.M7(A15) U5.U18(SA16)
SBA0: U2.M2(BA0) U5.P20(SBG0)
SBA1: U2.N8(BA1) U5.U15(SA11)
SBA2: U2.M3(BA2) U5.U20(SA6)
SCAS: U2.K3(CAS#) U5.N16(SA9)
SCKE0: U2.K9(CKE0) U5.V15(SCKE0)
SCKE1: U2.J9(CKE1) U5.P13(SCKE1)
SCKN: R7.2 U2.K7(CK_N) U5.U14(SCKN)
SCKP: R7.1 U2.J7(CK_P) U5.T14(SCKP)
SCS0: U2.L2(CS0#) U5.P21(SBG1)
SCS1: U2.L1(CS1#) U5.N19(SA7)
SDC0_CLK: D5.2 R13.1 SIM1.5(CLK)
SDC0_CMD: D4.2 SIM1.3(CMD) U5.K3(PF3/SDC0_CMD/JTAG_DO/PF_EINT3)
SDC0_D0: D6.2 SIM1.7(DAT0) U5.J3(PF1/SDC0_D0/JTAG_DI/PF_EINT1)
SDC0_D1: D7.2 SIM1.8(DAT1) U5.J2(PF0/SDC0_D1/JTAG_MS/PF_EINT0)
SDC0_D2: D2.2 SIM1.1(DAT2) U5.L3(PF5/SDC0_D2/JTAG_CK/PF_EINT5)
SDC0_D3: D3.2 SIM1.2(CD/DAT3) U5.L2(PF4/SDC0_D3/UART0_RX/PF_EINT4)
SDC0_DET: R15.1 U5.K2(PF6/PF_EINT6)
SDC1_CLK: R14.1 U3.16(SDIO_CLK)
SDC1_CMD: R21.2 U3.12(SDIO_CMD) U5.C7(PG1/SDC1_CMD/PG_EINT1)
SDC1_D0: R22.2 U3.13(SDIO_D0) U5.C6(PG2/SDC1_D0/PG_EINT2)
SDC1_D1: R23.2 U3.14(SDIO_D1) U5.B5(PG3/SDC1_D1/PG_EINT3)
SDC1_D2: R24.2 U3.17(SDIO_D2) U5.C5(PG4/SDC1_D2/PG_EINT4)
SDC1_D3: R25.2 U3.15(SDIO_D3) U5.B7(PG5/SDC1_D3/PG_EINT5)
SDC2_CLK: R12.1 U4.M6(CLK)
SDC2_CMD: R50.2 U4.M5(CMD) U5.E2(PC6/NAND_RB0/SDC2_CMD/BOOT_SEL4/PC_EINT6)
SDC2_D0: U4.A3(DAT0) U5.F2(PC10/NAND_DQ5/SDC2_D0/PC_EINT10)
SDC2_D1: U4.A4(DAT1) U5.G3(PC13/NAND_DQ3/SDC2_D1/PC_EINT13)
SDC2_D2: U4.A5(DAT2) U5.H2(PC15/NAND_DQ1/SDC2_D2/SPI0_WP/PC_EINT15)
SDC2_D3: U4.B2(DAT3) U5.E3(PC8/NAND_DQ7/SDC2_D3/PC_EINT8)
SDC2_D4: U4.B3(DAT4) U5.F1(PC9/NAND_DQ6/SDC2_D4/PC_EINT9)
SDC2_D5: U4.B4(DAT5) U5.F3(PC11/NAND_DQ4/SDC2_D5/PC_EINT11)
SDC2_D6: U4.B5(DAT6) U5.H1(PC14/NAND_DQ2/SDC2_D6/PC_EINT14)
SDC2_D7: U4.B6(DAT7) U5.H3(PC16/NAND_DQ0/SDC2_D7/SPI0_HOLD/PC_EINT16)
SDC2_DS: R51.2 U4.H5(DS) U5.B1(PC0/NAND_WE/SDC2_DS/SPI0_CLK/PC_EINT0)
SDC2_RST: U4.K5(RST_n) U5.C2(PC1/NAND_ALE/SDC2_RST/PC_EINT1)
SDQ0: U2.A2(DQU5) U5.N3(SDQ0)
SDQ1: U2.C8(DQU2) U5.U4(SDQ1)
SDQ2: U2.C2(DQU3) U5.N2(SDQ2)
SDQ3: U2.D7(DQU0) U5.T4(SDQ3)
SDQ4: U2.B8(DQU6) U5.U3(SDQ4)
SDQ5: U2.C3(DQU1) U5.P1(SDQ5)
SDQ6: U2.A7(DQU4) U5.T2(SDQ6)
SDQ7: U2.A3(DQU7) U5.P2(SDQ7)
SDQ8: U2.G2(DQL6) U5.P5(SDQ8)
SDQ9: U2.F7(DQL1) U5.V3(SDQ9)
SDQ10: U2.F2(DQL2) U5.P4(SDQ10)
SDQ11: U2.E3(DQL0) U5.R4(SDQ11)
SDQ12: U2.H8(DQL5) U5.R6(SDQ12)
SDQ13: U2.H3(DQL4) U5.N4(SDQ13)
SDQ14: U2.F8(DQL3) U5.P6(SDQ14)
SDQ15: U2.H7(DQL7) U5.N5(SDQ15)
SDQM0: U2.D3(DMU) U5.U1(SDQM0)
SDQM1: U2.E7(DML) U5.R3(SDQM1)
SDQS0N: U2.B7(DQSU#) U5.R1(SDQS0N)
SDQS0P: U2.C7(DQSU) U5.R2(SDQS0P)
SDQS1N: U2.G3(DQSL#) U5.V2(SDQS1N)
SDQS1P: U2.F3(DQSL) U5.U2(SDQS1P)
SODT0: U2.K1(ODT0) U5.N20(SODT1)
SODT1: U2.J1(ODT1) U5.N21(SBA0)
SRAS: U2.J3(RAS#) U5.T16(SA3)
SRST: U2.T2(RESET#) U5.U21(SRST)
SVREF: C58.2 C59.2 C60.2 R10.1 R11.2 U2.H1(VREFDQ) U2.M8(VREFCA)
SWE: U2.L3(WE#) U5.V20(SA14)
TV_OUT: AUDIO1.4 AUDIO1.7 D12.2 R30.2 U5.J21(TV_OUT)
UART1_CTS: U3.7(UART_RTS) U5.B3(PG9/UART1_CTS/JTAG_DI/AC_ADCY/PG_EINT9)
UART1_RTS: U3.8(UART_CTS) U5.C4(PG8/UART1_RTS/PLL_LOCK_DBG/JTAG_DO/PG_EINT8)
UART1_RX: U3.10(UART_TX) U5.B4(PG7/UART1_RX/JTAG_CK/PG_EINT7)
UART1_TX: U3.9(UART_RX) U5.A4(PG6/UART1_TX/JTAG_MS/PG_EINT6)
USB0_ID: D20.2(K) USB1.A5(CC1) USB1.B5(CC2)
USB_ID: R34.1 U5.A2(PG18/UART2_CTS/MCSI_SDA/TWI3_SDA/PG_EINT18)
WHXI: C80.1 U3.3(XTAL2) X1.1(OSC1)
WHXO: C85.1 U3.4(XTAL1) X1.3(OSC2)
WL_REG_ON: U3.24(WL_RSTN) U5.B10(PG11/H_I2S2_BCLK/BIST_RESULT0/AC_SYNC/PG_EINT11)
$1N16368: L1.1 U1.18(LX1)
$1N16426: L2.1 U1.19(LX2)
$1N16541: L3.1 U1.3(LX3)
$1N24681: C5.2 R1.2 U1.7(RTCLDO)
$1N28880: R4.2 U1.11(IRQ)
$1N28962: R5.2 U1.13(PWROK)
$1N30789: C12.2 U1.8(GPO)
$1N44518: D1.1(K) FAN1.1
$1N53902: LED1.1(A) R48.1
$2N2062: R6.1 U5.L15(SZQ)
$2N2223: R9.2 U2.L9(ZQ1)
$2N2224: R8.2 U2.L8(ZQ0)
$3N2117: C82.2 C83.2 U4.C2(VDDI)
$3N2831: R12.2 U5.D3(PC5/NAND_RE/SDC2_CLK/BOOT_SEL3/PC_EINT5)
$3N3551: R15.2 R16.2 SIM1.11
$3N5546: C66.2 R18.1 U3.40(ANT)
$3N5547: C67.2 JP1.1(SIG) R18.2
$3N5552: C73.1 U3.21(VDD12_DIG)
$3N5553: C70.1 U3.2(VDD12_CLK)
$3N5554: C71.1 U3.38(VDD33_PA)
$3N5561: C72.1 U3.26(VDD_RTC)
$3N5562: C74.1 C78.1 C79.1 C84.1 U3.1(VDD14_RX) U3.22(VDD14_DIG) U3.28(VDD_SENSE) U3.36(VDD14_TX)
$3N5564: R19.2 U3.6(BT_WKUP_HOST)
$3N5565: R20.2 U3.5(BT_HOST_WKUP)
$3N9917: R13.2 U5.K1(PF2/SDC0_CLK/UART0_TX/PF_EINT2)
$3N12389: R14.2 U5.A6(PG0/SDC1_CLK/PG_EINT0)
$3N73904: R52.1 U5.D2(PC4/NAND_CE0/SPI0_MISO/BOOT_SEL2/PC_EINT4)
$4N2198: C92.2 U5.J18(VRA1)
$4N2208: C93.2 U5.J17(VRA2)
$4N2209: R31.2 U5.K18(REXT)
$4N2219: C95.2 U5.D18(AC_AVCC)
$4N2220: C96.2 U5.C17(AC_VRA1)
$4N2243: C97.1 U5.D13(DXLDO_OUT)
$4N8213: R40.2 USB3.A5(CC1)
$4N8354: R43.1 USB3.B5(CC2)
$4N8495: R44.2 USB4.A5(CC1)
$4N8636: R46.1 USB4.B5(CC2)
$4N8777: R35.2 USB2.A5(CC1)
$4N8918: R36.1 USB2.B5(CC2)
$4N12583: D20.1(A) R33.1 R34.2
$4N26086: D23.1(K) R37.1
$4N34203: AUDIO1.3 AUDIO1.6 C91.2 D10.2
$4N34315: AUDIO1.2 AUDIO1.5 C89.2 D8.2
$4N36516: C88.2 R27.1
$4N36638: C90.2 R29.1
$4N42572: C87.1 R28.2 RESET.1 RESET.2

Not connected (* = marked no-connect by the designer): HDMIOUT 14(HEC)*; U1 10(NC)* 14(PWRON)*; U3 18(CLKREQO)* 27(VDD25_EF)* 29(VDD_VLX)* 31(PCM_CLK)* 32(PCM_DOUT)* 33(PCM_DIN)* 34(PCM_SYNC)* 39(NC)*; U4 G3(RFU)*; U5 A8(PG15/UART2_TX/TWI4_SCK/PG_EINT15)* B2(PG19/MCSI_MCLK/PWM1/PG_EINT19)* B8(PG16/UART2_RX/TWI4_SDA/PG_EINT16)* B9(PG14/H_I2S2_DIN0/H_I2S2_DOUT1/BIST_RESULT3/AC_ADCX/PG_EINT14)* C3(PG17/UART2_RTS/MCSI_SCK/TWI3_SCK/PG_EINT17)* C11(REFCLK_OUT)* C16(JTAG_SEL)* D1(PC3/NAND_CE1/SPI0_CS0/BOOT_SEL1/PC_EINT3)* D14(PLLTEST)* F4(PC7/NAND_RB1/SPI0_CS1/PC_EINT7)* G2(PC12/NAND_DQS/PC_EINT12)* L18(LRADC)* N7(SDQ26)* N10(SDQM3)* P7(SDQ25)* P9(SDQ27)* P10(SDQ28)* P12(SDQ30)* R9(SDQ24)* R12(SDQ31)* T5(SDQ23)* T6(SDQ20)* T7(SDQ22)* T9(SDQM2)* T11(SDQ16)* T12(SDQ18)* U5(SDQ21)* U8(SDQS2N)* U9(SDQ19)* U10(SDQS3N)* U11(SDQ29)* U12(SDQ17)* V8(SDQS2P)* V10(SDQS3P)*; USB1 A8(SBU1)* B8(SBU2)*; USB2 A8(SBU1)* B8(SBU2)*; USB3 A8(SBU1)* B8(SBU2)*; USB4 A8(SBU1)* B8(SBU2)*

## Notes on the sheets
sheet 1
- 0807 RGB LED
sheet 3
- 1101 BOOT SEL: SDCARD -> EMMC
sheet 4
- DEBUG BTNs
- The external network transformer
  must be connected
- USB Type A2C Only
  > For USB OTG
